# EAGLE schematic PocketBelaCape_rev2 (EAGLE 6.5.0)

## Sheet 1 of 2
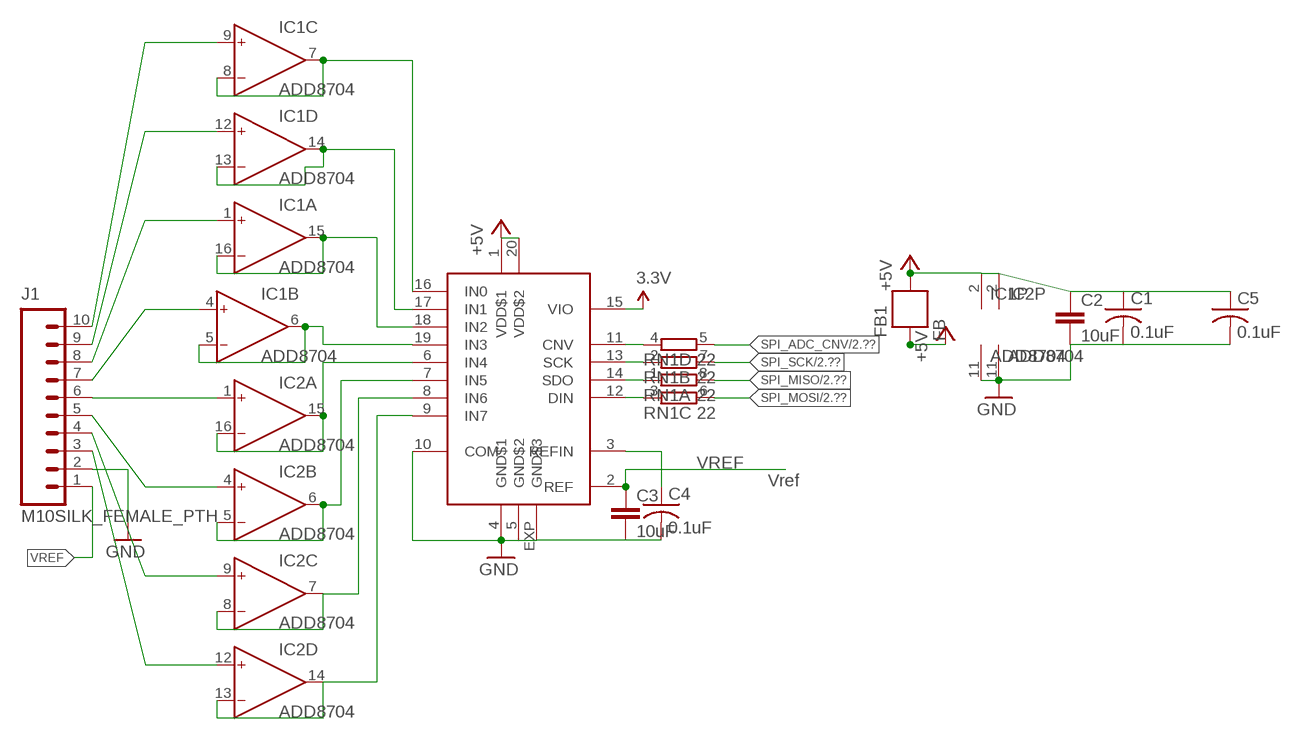
[diagram p0: schematic, sheet 1]

### Parts
C1  0.1uF  C-USC0603  [C0603]
C2  10uF  CAP0603-CAP  [0603-CAP]
C3  10uF  CAP0603-CAP  [0603-CAP]
C4  0.1uF  C-USC0603  [C0603]
C5  0.1uF  C-USC0603  [C0603]
FB1  FB  [0603]
IC1  ADD8704  [QFN16-3X3]
IC2  ADD8704  [QFN16-3X3]
IC3  AD7699  [LFCSP20-LEADS]
J1  M10SILK_FEMALE_PTH  [1X10]
RN1  22  4R-N0603-ARC  [0603-ARC]

### Nets
3.3V: IC3.15(VIO) ; also sheet 2
+5V_ADC_DAC: C1.1 C2.1 C5.1 FB1.1 IC1.2(P:V+) IC2.2(P:V+) IC3.1(VDD$1) IC3.20(VDD$2) ; supply symbol labelled +5V
+5V_SYS: FB1.2 ; supply symbol labelled +5V ; also sheet 2
GND: C1.2 C2.2 C3.2 C4.2 C5.2 IC1.11(P:V-) IC2.11(P:V-) IC3.4(GND$1) IC3.5(GND$2) IC3.10(COM) IC3.EXP(GND$3) J1.2 ; also sheet 2
N$4: IC2.1(A:IN+) J1.6
N$7: IC1.7(C:OUT) IC1.8(C:IN-) IC3.16(IN0)
N$8: IC1.13(D:IN-) IC1.14(D:OUT) IC3.17(IN1)
N$9: IC2.15(A:OUT) IC2.16(A:IN-) IC3.6(IN4)
N$10: IC2.5(B:IN-) IC2.6(B:OUT) IC3.7(IN5)
N$11: IC2.7(C:OUT) IC2.8(C:IN-) IC3.8(IN6)
N$12: IC2.13(D:IN-) IC2.14(D:OUT) IC3.9(IN7)
N$14: IC3.11(CNV) RN1.4
N$20: IC3.12(DIN) RN1.3
N$22: C4.1 IC3.3(REFIN)
N$23: IC3.13(SCK) RN1.2
N$24: IC3.14(SDO) RN1.1
N$27: IC1.5(B:IN-) IC1.6(B:OUT) IC3.19(IN3)
N$30: IC1.15(A:OUT) IC1.16(A:IN-) IC3.18(IN2)
N$37: IC1.9(C:IN+) J1.10
N$38: IC1.12(D:IN+) J1.9
N$39: IC1.1(A:IN+) J1.8
N$40: IC1.4(B:IN+) J1.7
N$42: IC2.4(B:IN+) J1.5
N$43: IC2.9(C:IN+) J1.4
N$44: IC2.12(D:IN+) J1.3
SPI_ADC_CNV: RN1.5 ; also sheet 2
SPI_MISO: RN1.8 ; also sheet 2
SPI_MOSI: RN1.6 ; also sheet 2
SPI_SCK: RN1.7 ; also sheet 2
VREF: C3.1 IC3.2(REF) J1.1

### Notes on the sheet
- Vref

## Sheet 2 of 2
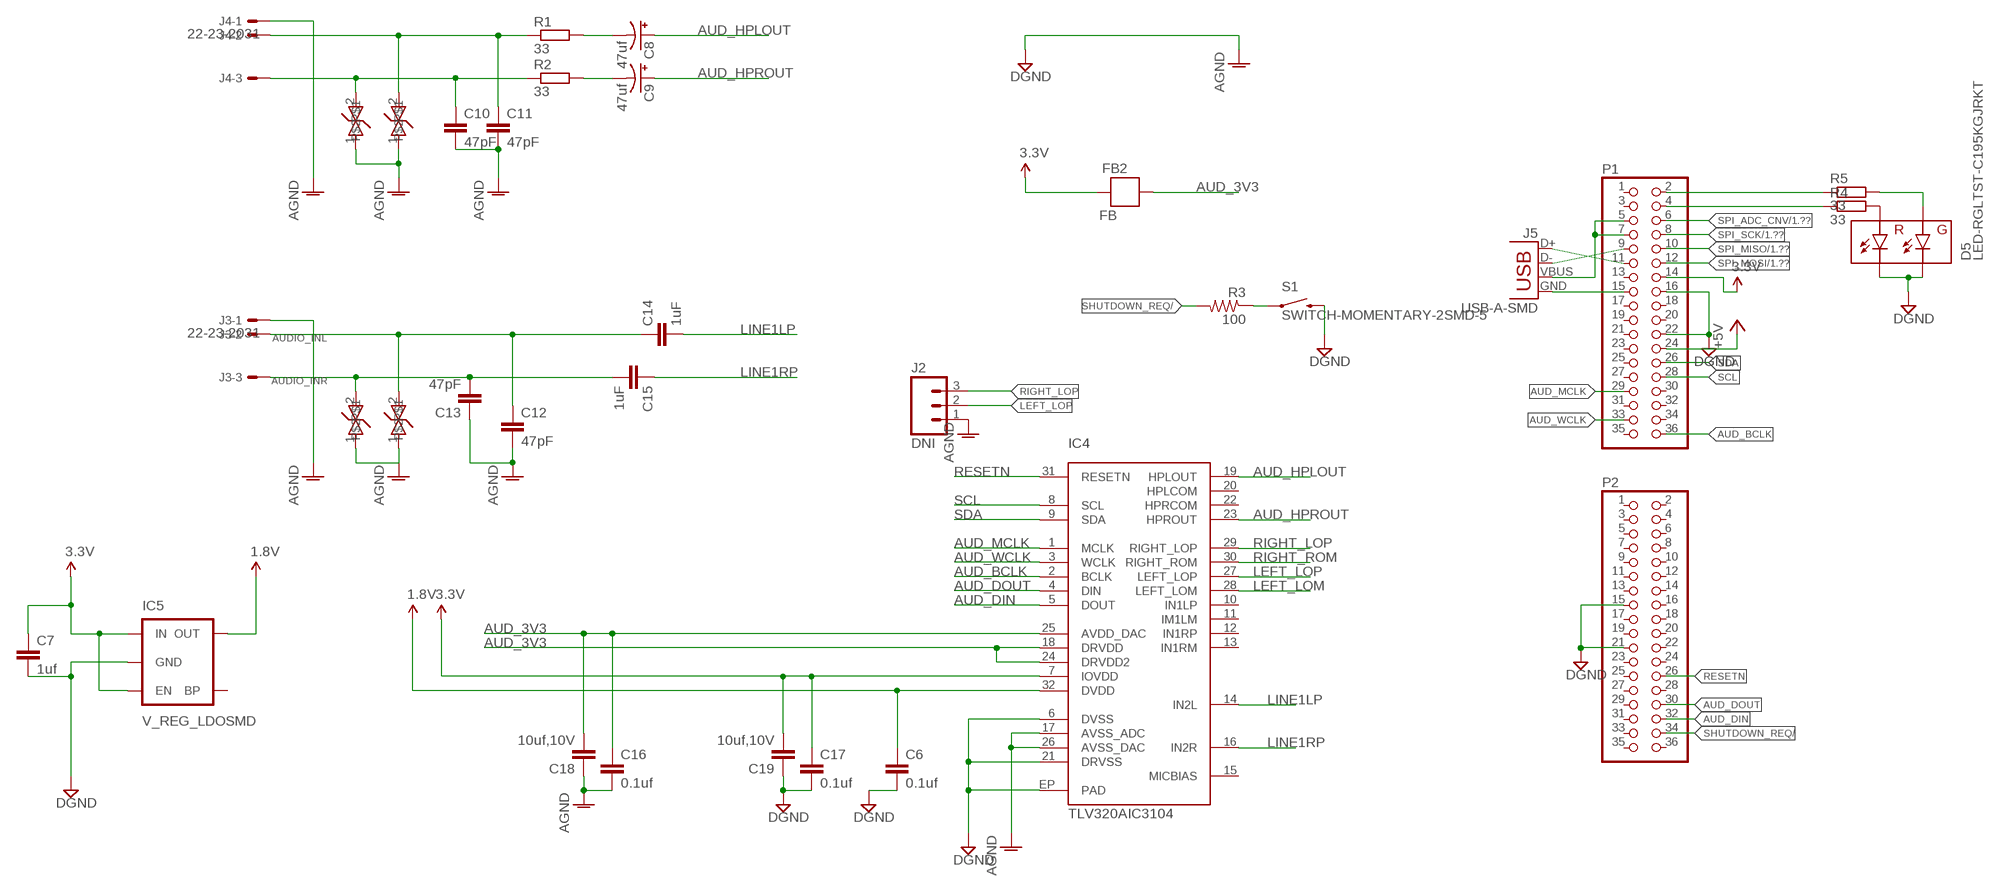
[diagram p1: schematic, sheet 2]

### Parts
C6  0.1uf  C-EUC0603  [C0603]
C7  1uf  C-EUC0603  [C0603]
C8  47uf  CAP_POL1206  [EIA3216]
C9  47uf  CAP_POL1206  [EIA3216]
C10  47pF  C-EUC0603  [C0603]
C11  47pF  C-EUC0603  [C0603]
C12  47pF  C-EUC0603  [C0603]
C13  47pF  C-EUC0603  [C0603]
C14  1uF  C-EUC0603  [C0603]
C15  1uF  C-EUC0603  [C0603]
C16  0.1uf  C-EUC0603  [C0603]
C17  0.1uf  C-EUC0603  [C0603]
C18  10uf,10V  CAP0603-CAP  [0603-CAP]
C19  10uf,10V  CAP0603-CAP  [0603-CAP]
D1  PGB0010603MR  [0603]
D2  PGB0010603MR  [0603]
D3  PGB0010603MR  [0603]
D4  PGB0010603MR  [0603]
D5  LED-RGLTST-C195KGJRKT  [LTST-C195KGJRKT]
FB2  FB  [0603]
IC4  TLV320AIC3104  [QFN-32]
IC5  V_REG_LDOSMD  [SOT23-5]
J2  DNI  M03PTH  [1X03]
J3  22-23-2031  [22-23-2031]
J4  22-23-2031  [22-23-2031]
J5  USB-A-SMD  [USB-A-S-NOSILK-FEMALE]
P1  PINHD-2X18  [2X18]
P2  PINHD-2X18  [2X18]
R1  33  R-EU_R0603  [R0603]
R2  33  R-EU_R0603  [R0603]
R3  100  R-US_R0603  [R0603]
R4  33  R-EU_R0603  [R0603]
R5  33  R-EU_R0603  [R0603]
S1  SWITCH-MOMENTARY-2SMD-5  [TACTILE_SWITCH_SMD-4]

### Nets
1.8V: C6.1 IC4.32(DVDD) IC5.5(OUT)
3.3V: C7.1 C17.1 C19.2 FB2.2 IC4.7(IOVDD) IC5.1(IN) IC5.3(EN) P1.14 ; also sheet 1
+5V_SYS: P1.24 ; supply symbol labelled +5V ; also sheet 1
AUD_3V3: C16.1 C18.2 FB2.1 IC4.18(DRVDD) IC4.24(DRVDD2) IC4.25(AVDD_DAC)
AUD_BCLK: IC4.2(BCLK) P1.36
AUD_DIN: IC4.5(DOUT) P2.32
AUD_DOUT: IC4.4(DIN) P2.30
AUD_HPLOUT: C8.A(+) IC4.19(HPLOUT)
AUD_HPROUT: C9.A(+) IC4.23(HPROUT)
AUD_MCLK: IC4.1(MCLK) P1.29
AUD_WCLK: IC4.3(WCLK) P1.33
AUDIO_INL: C12.1 C14.1 D4.2 J3.2
AUDIO_INR: C13.2 C15.2 D3.2 J3.3
GND: C6.2 C7.2 C10.2 C11.2 C12.2 C13.1 C16.2 C17.2 C18.1 C19.1 D1.1 D2.1 D3.1 D4.1 D5.P$3(GC) D5.P$4(RC) IC4.6(DVSS) IC4.17(AVSS_ADC) IC4.21(DRVSS) IC4.26(AVSS_DAC) IC4.EP(PAD) IC5.2(GND) J2.1 J3.1 J4.1 P1.16 P1.22 P2.15 P2.21 S1.4 ; supply symbol labelled DGND, AGND ; also sheet 1
HPL: C11.1 D2.2 J4.2 R1.1
HPR: C10.1 D1.2 J4.3 R2.1
LEFT_LOM: IC4.28(LEFT_LOM)
LEFT_LOP: IC4.27(LEFT_LOP) J2.2
LINE1LP: C14.2 IC4.14(IN2L)
LINE1RP: C15.1 IC4.16(IN2R)
N$1: J5.VBUS P1.5 P1.7
N$2: J5.D- P1.9
N$3: J5.D+ P1.11
N$6: D5.P$2(RA) R4.2
N$13: D5.P$1(GA) R5.2
N$15: P1.4 R4.1
N$16: P1.2 R5.1
N$54: C8.C(-) R1.2
N$58: R3.1 S1.1
N$59: C9.C(-) R2.2
RESETN: IC4.31(RESETN) P2.26
RIGHT_LOP: IC4.29(RIGHT_LOP) J2.3
RIGHT_ROM: IC4.30(RIGHT_ROM)
SCL: IC4.8(SCL) P1.28
SDA: IC4.9(SDA) P1.26
SHUTDOWN_REQ/: P2.34 R3.2
SPI_ADC_CNV: P1.6 ; also sheet 1
SPI_MISO: P1.10 ; also sheet 1
SPI_MOSI: P1.12 ; also sheet 1
SPI_SCK: P1.8 ; also sheet 1
USBGND: J5.GND P1.15
Unconnected: IC4.10(IN1LP) IC4.11(IM1LM) IC4.12(IN1RP) IC4.13(IN1RM) IC4.15(MICBIAS) IC4.20(HPLCOM) IC4.22(HPRCOM) IC5.4(BP) P1.1 P1.3 P1.13 P1.17 P1.18 P1.19 P1.20 P1.21 P1.23 P1.25 P1.27 P1.30 P1.31 P1.32 P1.34 P1.35 P2.1 P2.2 P2.3 P2.4 P2.5 P2.6 P2.7 P2.8 P2.9 P2.10 P2.11 P2.12 P2.13 P2.14 P2.16 P2.17 P2.18 P2.19 P2.20 P2.22 P2.23 P2.24 P2.25 P2.27 P2.28 P2.29 P2.31 P2.33 P2.35 P2.36

## Library data of the parts
C1 C4 C5 = rcl:C-US: CAPACITOR, American symbol
C2 C3 = SparkFun-Passives:CAP: Capacitor Standard 0603 ceramic capacitor, and 0.1" leaded capacitor.
C6 C16 C17 = rcl:C-EU: CAPACITOR, European symbol; MANEX: 123-0001056
C7 = rcl:C-EU: CAPACITOR, European symbol; MANEX: 123-0001087
C8 C9 = SparkFun-Capacitors:CAP_POL: Capacitor Polarized These are standard SMD and PTH capacitors. Normally 10uF, 47uF, and 100uF in electrolytic and tantalum varieties. Always verify the external diameter of the through hole cap, it varies with capacity, voltage, and manufacturer. The EIA devices should be standard.; MANEX: 123-0001196
C10-C13 = rcl:C-EU: CAPACITOR, European symbol; MANEX: 123-0001115
C14 C15 = rcl:C-EU: CAPACITOR, European symbol; MANEX: 123-0001032
C18 C19 = SparkFun-Passives:CAP: Capacitor Standard 0603 ceramic capacitor, and 0.1" leaded capacitor.; MANEX: 123-0001127
D1-D4 = CircuitCo:PGB0010603MR; MANEX: 130-0001371
D5 = SparkFun-LED:LED-RG; PROD_ID: DIO-12140
FB1 = SparkFun-Passives:FB
FB2 = SparkFun-Passives:FB; MANEX: 126-0001418
IC1 IC2 = custom:ADD8704: 16 V Quad Operational Amplifier Source: Ananlog Devices .. 780914713ADD8704_0.pdf
IC3 = custom:AD7699
IC4 = CircuitCo:TLV320AIC3104; MANEX: 140-0004277
IC5 = SparkFun-PowerIC:V_REG_LDO: Voltage Regulator LDO Standard 150mA LDO voltage regulator in SOT-23 layout. Micrel part MIC5205. BP (by-pass) pin is used to lower output noise with 470pF cap.; MANEX: 140-0001616
J1 = SparkFun-Connectors:M10: Header 10 Standard 10-pin 0.1" header. Use with straight break away headers (SKU : PRT-00116), right angle break away headers (PRT-00553), swiss pins (PRT-00743), machine pins (PRT-00117), and female headers (PRT-00115).; PROD_ID: CONN-11563
J2 = SparkFun-Connectors:M03: Header 3 Standard 3-pin 0.1" header. Use with straight break away headers (SKU : PRT-00116), right angle break away headers (PRT-00553), swiss pins (PRT-00743), machine pins (PRT-00117), and female headers (PRT-00115). Molex polarized connector foot print use with SKU : PRT-08232 with associated crimp pins and housings.
J3 J4 = con-molex:22-23-2031: .100" (2.54mm) Center Header - 3 Pin; MF: MOLEX; MPN: 22-23-2031; OC_FARNELL: 1462950; OC_NEWARK: 30C0862
J5 = SparkFun-Connectors:USB: USB Connectors USB-B-PTH is fully proven SKU : PRT-00139/CONN-08278 USB-miniB is fully proven SKU : PRT-00587 USB-A-PCB is untested. USB-A-H is throughly reviewed, but untested. Spark Fun Electronics SKU : PRT-00437 USB-B-SMT is throughly reviewed, but untested. Needs silkscreen touching up. USB-A-S has not been used/tested USB-MB-H has not been used/tested USB-MICROB has been used. CONN-09505; PROD_ID: CONN-09520
P1 P2 = pinhead:PINHD-2X18: PIN HEADER
R1 R2 R4 R5 = rcl:R-EU_: RESISTOR, European symbol; MANEX: 110-0002014
R3 = rcl:R-US_: RESISTOR, American symbol
RN1 = resistor-dil:4R-N: Array Chip Resistor Source: RS Component / Phycomp; OC_FARNELL: unknown; OC_NEWARK: unknown
S1 = custom:SWITCH-MOMENTARY-2: Various NO switches- pushbuttons, reed, etc